# Altium project WR_NIC.PrjPcb (part 1 of 3)
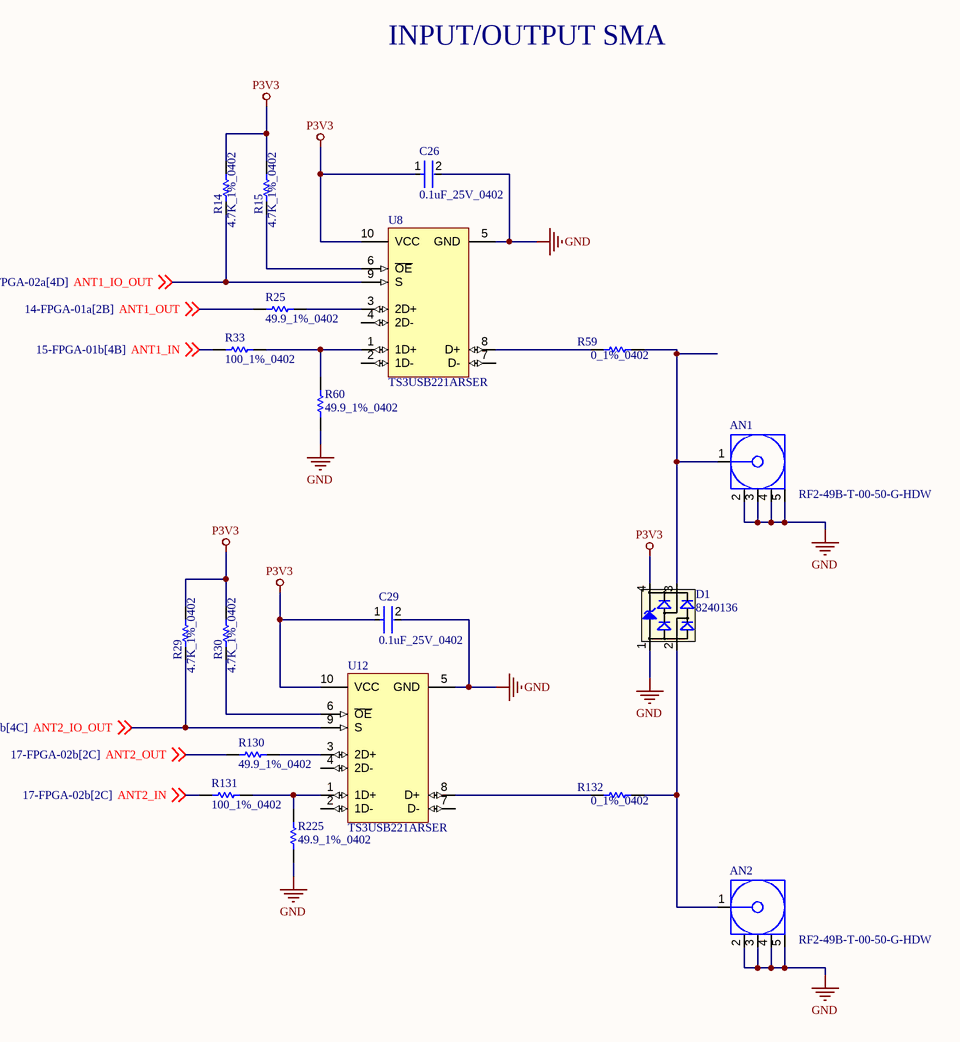
[diagram p0: 02-USER_IO.SchDoc]
ProjectDate: 09/14/21; ProjectRevision: P3
10 sheets, 312 parts. Net scope: global (net labels, ports and power ports of the same name join across sheets).
Board file: WR_NIC_V1.PcbDoc
Sheets:
  02-USER_IO.SchDoc
  03-USER_IO_STATUS.SchDoc
  07-DPLL-1.SchDoc
  10-JTAG.SchDoc
  11-DisplayPort.SchDoc
  12-USB Phy and Hub.SchDoc
  15-FPGA-01b.SchDoc
  17-FPGA-02b.SchDoc
  18-Power-P3V3.SchDoc
  19-Power-P5V.SchDoc

## Sheet 02-USER_IO.SchDoc
size Tabloid; DocumentNumber: 1; SheetNumber: 2; SheetTotal: 17

### Parts
AN1  RF2-49B-T-00-50-G-HDW  [AMPH-901-143-6RFX_V]
AN2  RF2-49B-T-00-50-G-HDW  [AMPH-901-143-6RFX_V]
C26  0.1uF_25V_0402  [FP-0402-L_1_0_1-W_0_5_0_1-IPC_C]
C29  0.1uF_25V_0402  [FP-0402-L_1_0_1-W_0_5_0_1-IPC_C]
D1  8240136  [SOT143-4L]
R14  4.7K_1%_0402  [RESC1005X40X25NL10T10]
R15  4.7K_1%_0402  [RESC1005X40X25NL10T10]
R25  49.9_1%_0402  [RESC1005X40X25NL10T10]
R29  4.7K_1%_0402  [RESC1005X40X25NL10T10]
R30  4.7K_1%_0402  [RESC1005X40X25NL10T10]
R33  100_1%_0402  [RESC1005X40X25NL05T10]
R59  0_1%_0402  [RESC1005X40X25LL05T05]
R60  49.9_1%_0402  [RESC1005X40X25NL10T10]
R130  49.9_1%_0402  [RESC1005X40X25NL10T10]
R131  100_1%_0402  [RESC1005X40X25NL05T10]
R132  0_1%_0402  [RESC1005X40X25LL05T05]
R225  49.9_1%_0402  [RESC1005X40X25NL10T10]
U8  TS3USB221ARSER  [RSE0010A_V]
U12  TS3USB221ARSER  [RSE0010A_V]

### Nets
GND: AN1.2 AN1.3 AN1.4 AN1.5 AN2.2 AN2.3 AN2.4 AN2.5 C26.2 C29.2 D1.1(GND) R60.1 R225.1 U8.5(GND) U12.5(GND)
P3V3: C26.1 C29.1 D1.4(VDD) R14.1 R15.1 R29.1 R30.1 U8.10(VCC) U12.10(VCC)
ANT1_IN: R33.1 ; off-sheet ANT1_IN
ANT1_IO_OUT: R14.2 U8.9(S) ; off-sheet ANT1_IO_OUT
ANT1_OUT: R25.1 ; off-sheet ANT1_OUT
ANT2_IN: R131.1 ; off-sheet ANT2_IN
ANT2_IO_OUT: R29.2 U12.9(S) ; off-sheet ANT2_IO_OUT
ANT2_OUT: R130.1 ; off-sheet ANT2_OUT
NetAN1_1: AN1.1 D1.3(I/O2) R59.2
NetAN2_1: AN2.1 D1.2(I/O1) R132.2
NetR15_2: R15.2 U8.6(~{OE})
NetR25_2: R25.2 U8.3(2D+)
NetR30_2: R30.2 U12.6(~{OE})
NetR33_2: R33.2 R60.2 U8.1(1D+)
NetR59_1: R59.1 U8.8(D+)
NetR130_2: R130.2 U12.3(2D+)
NetR131_2: R131.2 R225.2 U12.1(1D+)
NetR132_1: R132.1 U12.8(D+)

Not connected (* = marked no-connect by the designer): U8 2(1D-) 4(2D-) 7(D-); U12 2(1D-) 4(2D-) 7(D-)

### Notes on the sheet
- INPUT/OUTPUT SMA
- SHEET
- REV
- timingcard.com <http://timingcard.com>
- DATE
- OF

### Library data of the parts
AN1 AN2 = CMP-2000-05705-1: Coaxial connector, 50 Ohm, -65 to 165 degC, 5-Pin THD, RoHS, Bulk; Manufacturer: Amphenol; Catalog Drawings: 901-143-6RFXMountingHole; 3D Model: 901-143-6RFX.igs; Body Material: Brass; Connector Type: Jack,FemaleSocket; Shield Termination: Solder; Other Names: 901-143-6-RFX9011436RFXARFX1232; Online Catalog: SMA,RFX; Frequency - Max: 18GHz; Body Finish: Gold; Dielectric Material: Polytetrafluoroethylene(PTFE); Center Contact Material: BerylliumCopper; Impedance: 50Ohm; Connector Style: SMA; Mounting Technology: ThroughHole; Mounting Type: ThroughHole,RightAngle; Cable Group: -; Series: -; Package Description: 5-Pin Through Hole Device, Body 7 x 7 mm, Pitch 2.54 mm; Package Reference: 901-143-6RFX; Voltage Rating: -; Standard Package: 1; Fastening Type: Threaded; Housing Color: Gold; Datasheet URL: http://www.amphenolrf.com/downloads/dl/file/id/2712/product/3102/901_143_6rfx_customer_drawing.pdf; Family: CoaxialConnectors(RF); Contact Termination: Solder; Manufacturer URL: http://www.amphenol.com/; Operating Temperature: -65°C~165°C; Category: Connectors,Interconnects; Packaging: Bulk; Features: -; Center Contact Plating: Gold; Datasheet Version: Rev. C, 06/2010; Ingress Protection: -
C26 C29 = CMP-2008-02519-2: General Purpose Ceramic Capacitor, 0402, 100nF, 10%, X7R, 15%, 25V; Package Quantity: 1; Capacitance: 100nF; Min Operating Temperature: -55°C; Voltage: 25V; Voltage Rating: 25V; Construction: Flat; Max Operating Temperature: 125°C; Radiation Hardening: No; Depth: 0.5mm; Thickness: 0.022inch; Voltage Rating (DC): 25V; Number of Pins: 2; Lead Free: Lead Free; Series: -; REACH SVHC: No SVHC; Length: 1mm; Dielectric: X7R; RoHS Compliant: Yes; Mount: Surface Mount; Packaging: Tape and Reel; Case/Package: 0402; Case Code (Imperial): 0402; Termination: SMD/SMT; Width: 0.02inch; Case Code (Metric): 1005; Tolerance: 10%
D1 = CMP-1486-00002-1: TVS Diode WE-TVS-HS, VRWM=3.3V; Manufacturer: Wuerth Elektronik; Reverse Stand Off Voltage: 3.3V; PartNumber: 8240136; ComponentLink1Description: Manufacturer URL; PackageReference: SOT143-4L; ComponentLink1URL: http://www.we-online.com; ComponentLink2Description: Datasheet; ComponentLink2URL: http://katalog.we-online.de/kataloge/eisos/media/pdf/8240136.pdf
R14 R15 R29 R30 = CMP-2002-05217-1: Manufacturer: Bourns; Part Number: CR0402-FX-4701GLF
R25 R60 R130 R225 = CMP-2002-04448-1: Part Number: RK73H1ETTP49R9F; Manufacturer: KOA Speer
R33 R131 = CMP-2002-07853-1: Manufacturer: Yageo; Part Number: RC0402FR-13100RL
R59 R132 = CMP-2000-07451-1: Chip Resistor, 0 Ohm, 0.1 W, -55 to 155 degC, 0402 (1005 Metric), RoHS, Tape and Reel; Manufacturer: Panasonic; Voltage Rating (DC): 50V; Temperature Coefficient: 600ppm/��C; Max Power Dissipation: 100mW; Resistance: 0mOhm; Tolerance: 5%; Number of Terminations: 2; Mount: SurfaceMount; Height: 0.35mm; Packaging: TapeandReel; Contact Plating: Tin; Manufacturer URL: http://www.panasonic.com/; Composition: ThickFilm; Max Operating Temperature: 155degC; REACH SVHC: NoSVHC; Case/Package: 0402; Package Reference: 402; Depth: 0.5mm; Package Description: 2-Pin Surface Mount Device, Body 1 x 0.5 mm; Datasheet URL: https://industrial.panasonic.com/cdbs/www-data/pdf/RDA0000/AOA0000C301.pdf; RoHSCompliant: True; Case Code (Imperial): 0402; Military Standard: Not; Min Operating Temperature: -55degC; Power Rating: 100mW; Datasheet Version: 03/2015; Length: 1mm; Case Code (Metric): 1005; Termination: SMD/SMT; Mounting Technology: SurfaceMount; Voltage Rating: 50V; Width: 0.02inch; Package Quantity: 1; Lead Free: LeadFree; Radiation Hardening: No
U8 U12 = CMP-0309-00017-2: ESD Protected,High-Speed USB 2.0 (480-Mbps) 1:2 Multiplexer / Demultiplexer Switch, 1:2 Mux / Demux, 6 ohm RON, 2.5 to 3.3V, -40 to 85 degC, 10-Pin UQFN (RSE), Green (RoHS & no Sb/Br); Manufacturer: Texas Instruments; tpd max(ns): 0.25; RON Mis-match(Max)(Ohms): 0.2; OFF Time(Max)(ns): 12; Architecture: "1","2 mux/demux"; IL OFF(Max)(nA): 2; SubFamily: USB Switch; ESD HBM(kV): +/-7; ron(max)(ohms): 6; ON Time(Max)(ns): 30; Bandwidth(MHz): 900; RON Flatness(Max)(Ohms): 1; Vcc range(V): 2.3 to 3.6; Mounting Technology: Surface Mount; ComponentLink2URL: http://www.ti.com/lit/ml/mpqf186c/mpqf186c.pdf; PackageDescription: 10-Leads Plastic Quad Flatpack No-Lead, 2 x 1.5 x 0.55 mm Body, 0.5 mm Pitch; ComponentLink1URL: http://www.ti.com/general/docs/lit/getliterature.tsp?genericPartNumber=TS3USB221A&fileType=pdf; PackageReference: RSE0010A; ComponentLink2Description: Package Specification; PartNumber: TS3USB221ARSER; Code_JEDEC: MO-288-UEFD; DatasheetVersion: SCDS277; ComponentLink1Description: Datasheet; Eco-Plan: Green (RoHS & no Sb/Br); Number of Channels: 2; PackageVersion: revD, Jan-2011; ICC(uA): 30

## Sheet 03-USER_IO_STATUS.SchDoc: Time Card
size B; SheetNumber: 3; SheetTotal: 19; ENG_APP_DATE: --/--/--; DSN_APP_DATE: --/--/--; CHK_APP_DATE: --/--/--
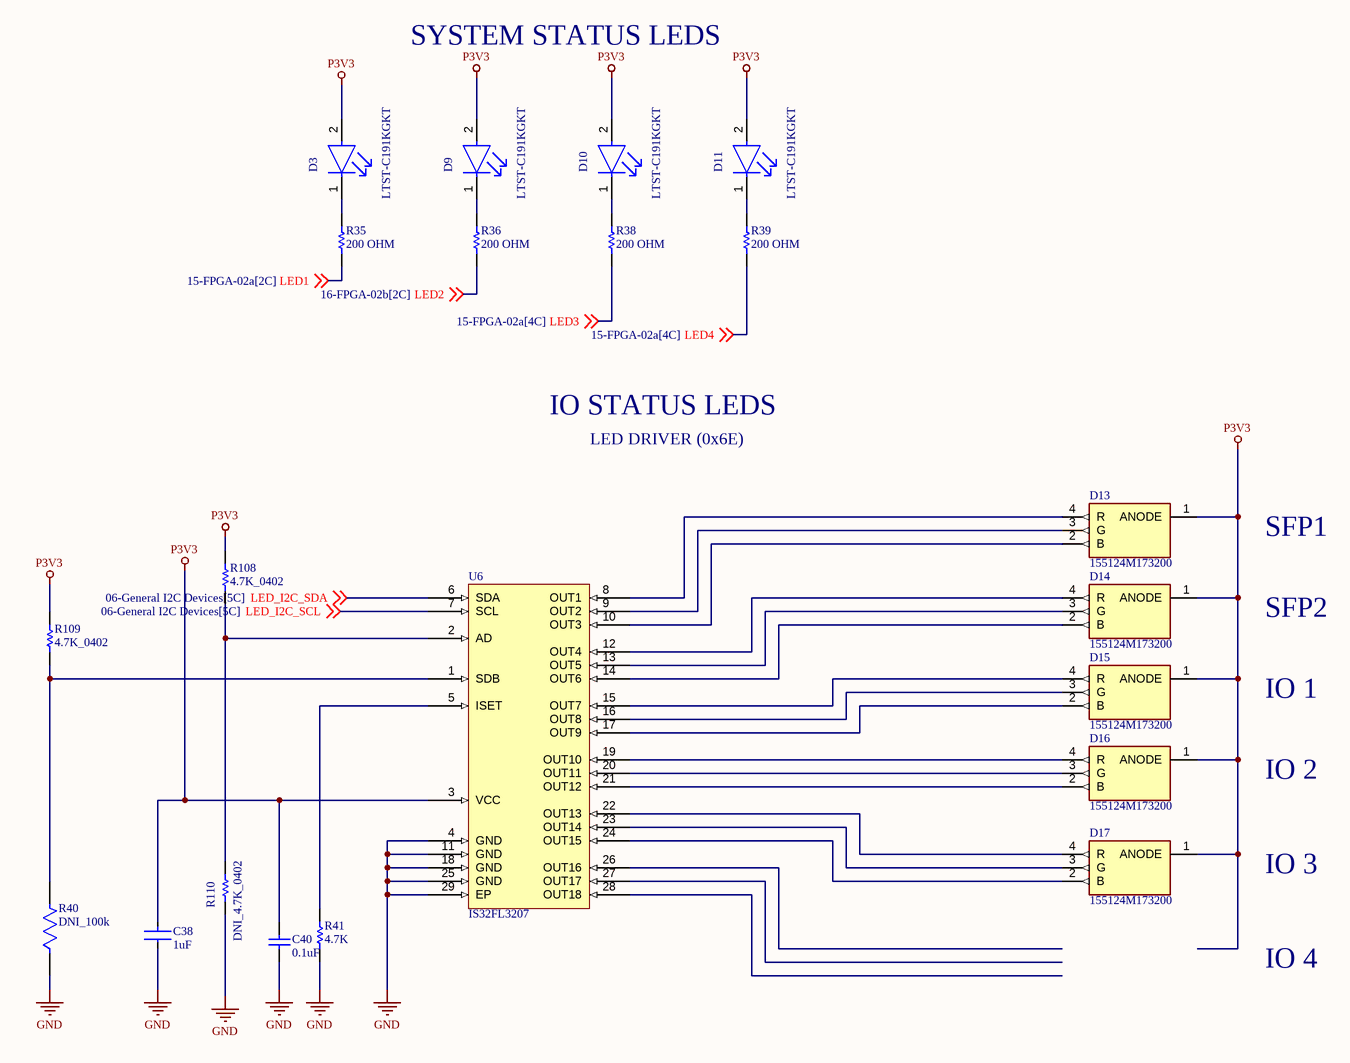
[diagram p1: 03-USER_IO_STATUS.SchDoc]

### Parts
C38  1uF  [FP-C0603C105K3PACTU-MFG]
C40  0.1uF  [CAPC1608X87X45ML20T05]
D3  LTST-C191KGKT  [FP-LTST-C191KGKT-MFG]
D9  LTST-C191KGKT  [FP-LTST-C191KGKT-MFG]
D10  LTST-C191KGKT  [FP-LTST-C191KGKT-MFG]
D11  LTST-C191KGKT  [FP-LTST-C191KGKT-MFG]
D13  155124M173200  [155124M173200]
D14  155124M173200  [155124M173200]
D15  155124M173200  [155124M173200]
D16  155124M173200  [155124M173200]
D17  155124M173200  [155124M173200]
R35  200 OHM  [RESC1608X55X30NL15T15]
R36  200 OHM  [RESC1608X55X30NL15T15]
R38  200 OHM  [RESC1608X55X30NL15T15]
R39  200 OHM  [RESC1608X55X30NL15T15]
R40  DNI_100k  [FP-RC0603-0_55-MFG]  (no BOM)
R41  4.7K  [RESC1608X55X30NL15T15]
R108  4.7K_0402  [RESC1005X40X25LL05T05]
R109  4.7K_0402  [RESC1005X40X25LL05T05]
R110  DNI_4.7K_0402  [RESC1005X40X25LL05T05]  (no BOM)
U6  IS32FL3207  [IS32FL3207]

### Nets
GND: C38.2 C40.1 R40.1 R41.1 R110.2 U6.4(GND) U6.11(GND) U6.18(GND) U6.25(GND) U6.29(EP)
P3V3: C38.1 C40.2 D3.2(A) D9.2(A) D10.2(A) D11.2(A) D13.1(ANODE) D14.1(ANODE) D15.1(ANODE) D16.1(ANODE) D17.1(ANODE) R108.1 R109.1 U6.3(VCC)
LED1: R35.1 ; off-sheet LED1
LED2: R36.1 ; off-sheet LED2
LED3: R38.1 ; off-sheet LED3
LED4: R39.1 ; off-sheet LED4
LED_I2C_SCL: U6.7(SCL) ; off-sheet LED_I2C_SCL
LED_I2C_SDA: U6.6(SDA) ; off-sheet LED_I2C_SDA
NetD3_1: D3.1(C) R35.2
NetD9_1: D9.1(C) R36.2
NetD10_1: D10.1(C) R38.2
NetD11_1: D11.1(C) R39.2
NetD13_2: D13.2(B) U6.10(OUT3)
NetD13_3: D13.3(G) U6.9(OUT2)
NetD13_4: D13.4(R) U6.8(OUT1)
NetD14_2: D14.2(B) U6.14(OUT6)
NetD14_3: D14.3(G) U6.13(OUT5)
NetD14_4: D14.4(R) U6.12(OUT4)
NetD15_2: D15.2(B) U6.17(OUT9)
NetD15_3: D15.3(G) U6.16(OUT8)
NetD15_4: D15.4(R) U6.15(OUT7)
NetD16_2: D16.2(B) U6.21(OUT12)
NetD16_3: D16.3(G) U6.20(OUT11)
NetD16_4: D16.4(R) U6.19(OUT10)
NetD17_2: D17.2(B) U6.24(OUT15)
NetD17_3: D17.3(G) U6.23(OUT14)
NetD17_4: D17.4(R) U6.22(OUT13)
NetR40_2: R40.2 R109.2 U6.1(SDB)
NetR41_2: R41.2 U6.5(ISET)
NetR108_2: R108.2 R110.1 U6.2(AD)

Not connected (* = marked no-connect by the designer): U6 26(OUT16) 27(OUT17) 28(OUT18)

### Notes on the sheet
- SYSTEM STATUS LEDS
- IO STATUS LEDS
- LED DRIVER (0x6E)
- SFP1
- SFP2
- IO 1
- IO 2
- IO 3
- IO 4
- DWG. NO.
- REV.
- SHT.
- THIS DOCUMENT AND THE DATA DISCLOSED HEREIN OR HEREWITH IS THE PROPERTY OF ALTIUM LIMITED AND MAY BE FREELY DISTRIBUTED IN WHOLE. NO RIGHTS ARE RESERVED OR EXPRESS OR IMPLIED WARANTEE GIVEN.
- REVISION
- DESCRIPTION
- DATE
- APPROVED
- ENG:
- APPROVALS
- PROJECT
- DSN:
- CHK:
- REFERENCE DOCUMENTS
- PROJECT REVISION:
- TITLE
- DOCUMENT REVISION:
- DESIGN ITEM:
- BOM:
- FAB DWG:
- PCB DWG:
- ASSY DWG:
- SCALE:
- SIZE
- B
- CAGE CODE
- FILE NAME
- DWG NO.
- SHEET
- OF
- REV

### Library data of the parts
C38 = CMP-2006-02216-3: CAP CER 1UF 25V X5R 0603; Dielectric Material: Ceramic; Tolerance: 10%; Contact Plating: Tin; Number of Pins: 2; Lead Free: Lead Free; Depth: 0.8mm; Length: 1.6mm; Mount: Surface Mount; Case Code (Metric): 1608; Max Operating Temperature: 85°C; Voltage: 25V; Voltage Rating (DC): 25V; REACH SVHC: No SVHC; Height: 0.8mm; Series: C0603C; Case/Package: 0603; Case Code (Imperial): 0603; Capacitance: 1uF; RoHS Compliant: Yes; Dielectric: X5R; Packaging: Tape and Reel; Construction: Flat; Thickness: 0.034inch; Voltage Rating: 25V; Radiation Hardening: No; Width: 0.031inch; Min Operating Temperature: -55°C; Termination: SMD/SMT; Package Quantity: 4000
C40 = CMP-2006-00003-1: C0603X104K5RACAUTO; Manufacturer: Kemet; Part Number: C0603X104K5RACAUTO
D3 D9-D11 = CMP-2000-05198-2: LED GREEN CLEAR SMD; Max Power Dissipation: 75mW; Forward Current: 30mA; Reverse Voltage: 5V; Lens Color: Colorless; Forward Voltage: 2V; Dominant Wavelength: 571nm; Number of LEDs: 1; Viewing Angle: 130°; Lens Style: Rectangular; Test Current: 20mA; Luminous Intensity: 35mcd; Wavelength: 574nm; Width: 0.8mm; Case Code (Imperial): 0603; Number of Pins: 2; Lead Free: Lead Free; Packaging: Tape and Reel; Package Quantity: 1; Min Operating Temperature: -55°C; Case/Package: 0603; Length: 1.6mm; Power Dissipation: 75mW; Depth: 0.8mm; Radiation Hardening: No; Mount: Surface Mount; Max Operating Temperature: 85°C; Color: Green; Power Rating: 75mW; Height: 0.55mm; Illumination Color: Green; Case Code (Metric): 1608; Lens Transparency: Clear; Number of Elements: 1
D13-D17 = 155124M173200: LED (Multiple); Manufacturer_Name: Wurth Elektronik; Datasheet Link: https://www.mouser.com/ds/2/445/155124M173200-1113601.pdf; Manufacturer_Part_Number: 155124M173200; Mouser Part Number: 710-155124M173200; Mouser Price/Stock: https://www.mouser.co.uk/ProductDetail/Wurth-Elektronik/155124M173200?qs=5aG0NVq1C4xPhoUU07x4gQ%3D%3D
R35 R36 R38 R39 = CMP-2000-00316-1: ERJ-3EKF2000V; Manufacturer: Panasonic; Part Number: ERJ-3EKF2000V
R40 = CMP-2100-03662-2: RES SMD 100K OHM 1% 1/10W 0603; Voltage Rating (DC): 50V; Resistance: 100kR; Max Power Dissipation: 100mW; Temperature Coefficient: 100ppm/°C; Working Voltage: 75V; Length: 1.6mm; Lead Free: Lead Free; Number of Terminations: 2; Packaging: Tape and Reel; Voltage Rating: 50V; Termination: SMD/SMT; Width: 0.8mm; Resistor Type: Thick Film; Resistance Tolerance: 1%; Features: Moisture Resistant; Height: 0.45mm; Construction: Rectangular; Case/Package: 0603; Military Standard: Not; Case Code (Imperial): 0603; Series: RC; Technology: THICK FILM; Depth: 0.8mm; RoHS Compliant: Yes; REACH SVHC: No SVHC; Min Operating Temperature: -55°C; Case Code (Metric): 1608; Max Operating Temperature: 155°C; Power Rating: 100mW; Number of Pins: 2; Tolerance: 1%
R41 = CMP-1012-00586-3: Precision Thick Film Chip Resistor, 4.7 KOhm, +/- 1%, -55 to 155 degC, 0603 (1608 Metric), RoHS, Tape and Reel ERJ-3EKF4701V; Resistance: 220 Ohm; Voltage Rating: 50 V; Elements: 4; Case\Package: 1205; Tolerance: 5%; Power Rating: 250 mW; PackageReference: 0603; Max Operating Temperature: 125 degC; REACH SVHC: No SVHC; Width: 0.063 inch; Length: 0.126 inch; Height: 0.024 inch; Mount: Surface Mount; Package Quantity: 1; DatasheetVersion: Apr-15; ComponentLink1Description: Manufacturer URL; Min Operating Temperature: -55 degC; Packaging: Tape and Reel; Radiation Hardening: No; ComponentLink2URL: http://industrial.panasonic.com/cdbs/www-data/pdf/RDA0000/AOA0000C86.pdf; Case Code (Metric): 3216; Pins: 8; Case Code (Imperial): 1206; Type (Resistor): Thick Film; RoHSCompliant: true; ComponentLink2Description: Datasheet; PackageDescription: 2-Pin Surface Mount Device, Body 1.6 x 0.85 mm; ComponentLink1URL: http://www.panasonic.com/
R108-R110 = CMP-2002-01154-4: Chip Resistor, 4.7 KOhm, +/- 1%, 0.1 W, -55 to 155 degC, 0402 (1005 Metric), RoHS, Tape and Reel; PartNumber: ERJ-2RKF4701X; Voltage Rating: 50 V; Case\/Package: 0402; Power Rating: 100 mW; Height: 0.35 mm; Mounting Technology: Surface Mount; REACH SVHC: Yes; Resistance: 4.7 KOhm; Max Operating Temperature: 155 degC; ComponentLink1Description: Manufacturer URL; ComponentLink2Description: Datasheet; Pins: 2; PackageReference: 0402; Tolerance: 1%; Case Code (Imperial): 0402; Length: 1 mm; PackageDescription: 2-Pin Surface Mount Device, Body 1 x 0.5 mm; RoHSCompliant: true; Package Quantity: 1; Radiation Hardening: No; DatasheetVersion: 04/2015; Width: 0.5 mm; Case Code (Metric): 1005; Mount: Surface Mount; ComponentLink1URL: http://www.panasonic.com/; Min Operating Temperature: -55 degC; Packaging: Cut Tape; ComponentLink2URL: http://industrial.panasonic.com/cdbs/www-data/pdf/RDA0000/AOA0000C86.pdf

## Sheet 07-DPLL-1.SchDoc
size B; SheetNumber: 7; SheetTotal: 20
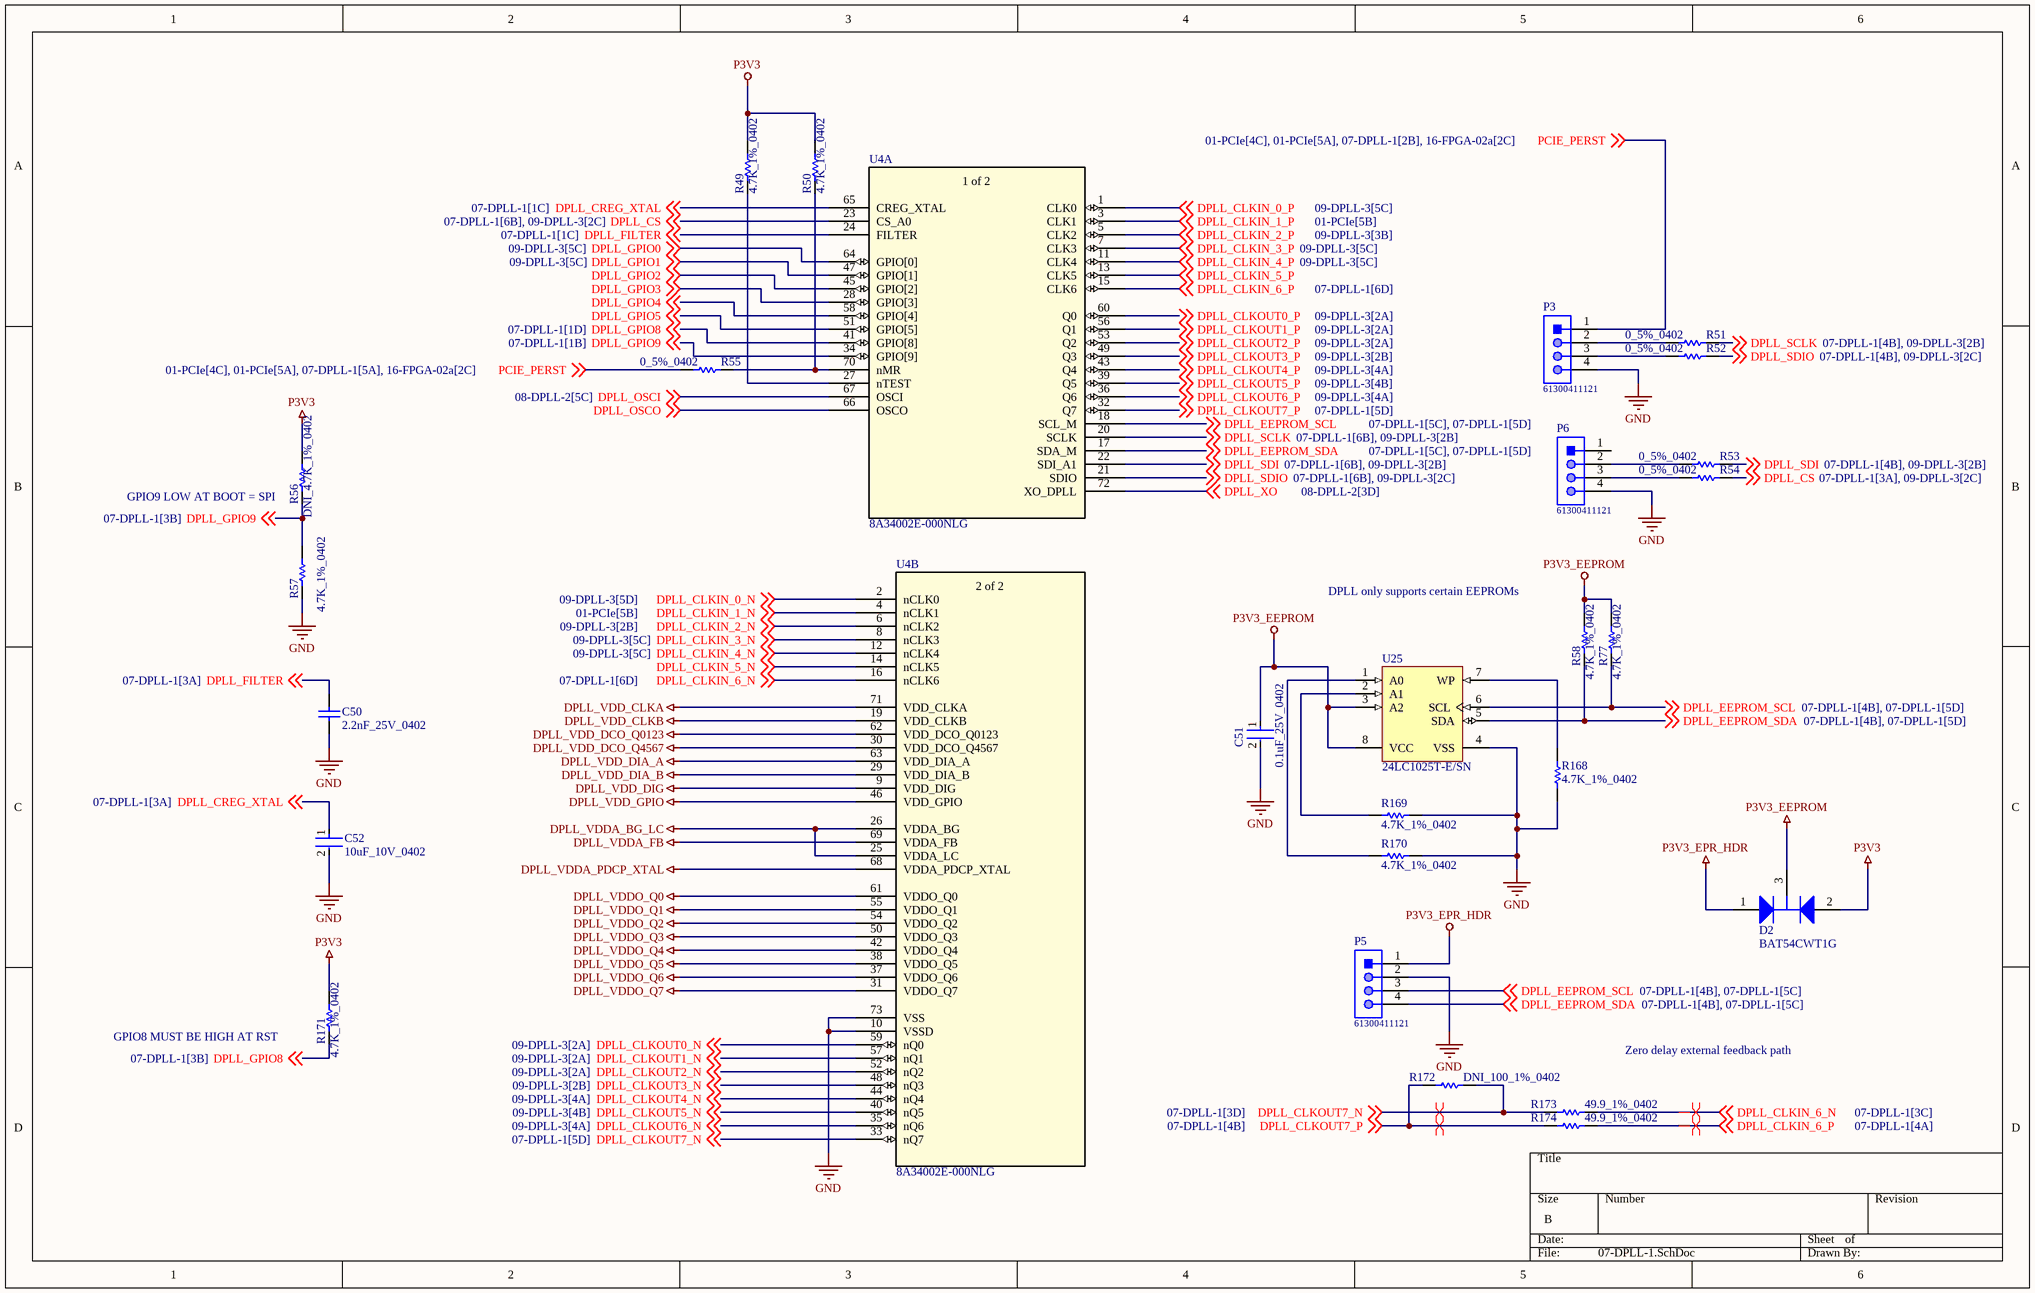
[diagram p2: 07-DPLL-1.SchDoc]

### Parts
C50  2.2nF_25V_0402  [CAPC1005X56X25LL10T15]
C51  0.1uF_25V_0402  [FP-0402-L_1_0_1-W_0_5_0_1-IPC_C]
C52  10uF_10V_0402  [FP-CL05A106MP5NUNC-MFG]
D2  BAT54CWT1G  [ONSC-SOT-323-3-419-04_V]
P3  61300411121  [61300411121]
P5  61300411121  [61300411121]
P6  61300411121  [61300411121]
R49  4.7K_1%_0402  [RESC1005X40X25NL10T10]
R50  4.7K_1%_0402  [RESC1005X40X25NL10T10]
R51  0_5%_0402  [RESC1005X40X25LL10T10]
R52  0_5%_0402  [RESC1005X40X25LL10T10]
R53  0_5%_0402  [RESC1005X40X25LL10T10]
R54  0_5%_0402  [RESC1005X40X25LL10T10]
R55  0_5%_0402  [RESC1005X40X25LL10T10]
R56  DNI_4.7K_1%_0402  [RESC1005X40X25NL10T10]  (no BOM)
R57  4.7K_1%_0402  [RESC1005X40X25NL10T10]
R58  4.7K_1%_0402  [RESC1005X40X25NL10T10]
R77  4.7K_1%_0402  [RESC1005X40X25NL10T10]
R168  4.7K_1%_0402  [RESC1005X40X25NL10T10]
R169  4.7K_1%_0402  [RESC1005X40X25NL10T10]
R170  4.7K_1%_0402  [RESC1005X40X25NL10T10]
R171  4.7K_1%_0402  [RESC1005X40X25NL10T10]
R172  DNI_100_1%_0402  [RESC1005X40X25LL05T05]  (no BOM)
R173  49.9_1%_0402  [RESC1005X40X25NL10T10]
R174  49.9_1%_0402  [RESC1005X40X25NL10T10]
U4  8A34002E-000NLG  [QFN_2E-000NLG_REN]  (parts A,B of 2)
U25  24LC1025T-E/SN  [SOIC-SN8_M]

### Nets
DPLL_VDD_CLKA: U4.71(VDD_CLKA)
DPLL_VDD_CLKB: U4.19(VDD_CLKB)
DPLL_VDD_DCO_Q0123: U4.62(VDD_DCO_Q0123)
DPLL_VDD_DCO_Q4567: U4.30(VDD_DCO_Q4567)
DPLL_VDD_DIA_A: U4.63(VDD_DIA_A)
DPLL_VDD_DIA_B: U4.29(VDD_DIA_B)
DPLL_VDD_DIG: U4.9(VDD_DIG)
DPLL_VDD_GPIO: U4.46(VDD_GPIO)
DPLL_VDDA_BG_LC: U4.25(VDDA_LC) U4.26(VDDA_BG)
DPLL_VDDA_FB: U4.69(VDDA_FB)
DPLL_VDDA_PDCP_XTAL: U4.68(VDDA_PDCP_XTAL)
DPLL_VDDO_Q0: U4.61(VDDO_Q0)
DPLL_VDDO_Q1: U4.55(VDDO_Q1)
DPLL_VDDO_Q2: U4.54(VDDO_Q2)
DPLL_VDDO_Q3: U4.50(VDDO_Q3)
DPLL_VDDO_Q4: U4.42(VDDO_Q4)
DPLL_VDDO_Q5: U4.38(VDDO_Q5)
DPLL_VDDO_Q6: U4.37(VDDO_Q6)
DPLL_VDDO_Q7: U4.31(VDDO_Q7)
GND: C50.1 C51.2 C52.2 P3.4 P5.2 P6.4 R57.1 R168.2 R169.1 R170.2 U4.10(VSSD) U4.73(VSS) U25.4(VSS)
P3V3: D2.2(A2) R49.2 R50.2 R56.1 R171.1
P3V3_EEPROM: C51.1 D2.3(K) R58.1 R77.1 U25.3(A2) U25.8(VCC)
P3V3_EPR_HDR: D2.1(A1) P5.1
DPLL_CLKIN_0_N: U4.2(nCLK0) ; off-sheet DPLL_CLKIN_0_N
DPLL_CLKIN_0_P: U4.1(CLK0) ; off-sheet DPLL_CLKIN_0_P
DPLL_CLKIN_1_N: U4.4(nCLK1) ; off-sheet DPLL_CLKIN_1_N
DPLL_CLKIN_1_P: U4.3(CLK1) ; off-sheet DPLL_CLKIN_1_P
DPLL_CLKIN_2_N: U4.6(nCLK2) ; off-sheet DPLL_CLKIN_2_N
DPLL_CLKIN_2_P: U4.5(CLK2) ; off-sheet DPLL_CLKIN_2_P
DPLL_CLKIN_3_N: U4.8(nCLK3) ; off-sheet DPLL_CLKIN_3_N
DPLL_CLKIN_3_P: U4.7(CLK3) ; off-sheet DPLL_CLKIN_3_P
DPLL_CLKIN_4_N: U4.12(nCLK4) ; off-sheet DPLL_CLKIN_4_N
DPLL_CLKIN_4_P: U4.11(CLK4) ; off-sheet DPLL_CLKIN_4_P
DPLL_CLKIN_5_N: U4.14(nCLK5) ; off-sheet DPLL_CLKIN_5_N
DPLL_CLKIN_5_P: U4.13(CLK5) ; off-sheet DPLL_CLKIN_5_P
DPLL_CLKIN_6_N: R173.2 U4.16(nCLK6) ; off-sheet DPLL_CLKIN_6_N
DPLL_CLKIN_6_P: R174.2 U4.15(CLK6) ; off-sheet DPLL_CLKIN_6_P
DPLL_CLKOUT0_N: U4.59(nQ0) ; off-sheet DPLL_CLKOUT0_N
DPLL_CLKOUT0_P: U4.60(Q0) ; off-sheet DPLL_CLKOUT0_P
DPLL_CLKOUT1_N: U4.57(nQ1) ; off-sheet DPLL_CLKOUT1_N
DPLL_CLKOUT1_P: U4.56(Q1) ; off-sheet DPLL_CLKOUT1_P
DPLL_CLKOUT2_N: U4.52(nQ2) ; off-sheet DPLL_CLKOUT2_N
DPLL_CLKOUT2_P: U4.53(Q2) ; off-sheet DPLL_CLKOUT2_P
DPLL_CLKOUT3_N: U4.48(nQ3) ; off-sheet DPLL_CLKOUT3_N
DPLL_CLKOUT3_P: U4.49(Q3) ; off-sheet DPLL_CLKOUT3_P
DPLL_CLKOUT4_N: U4.44(nQ4) ; off-sheet DPLL_CLKOUT4_N
DPLL_CLKOUT4_P: U4.43(Q4) ; off-sheet DPLL_CLKOUT4_P
DPLL_CLKOUT5_N: U4.40(nQ5) ; off-sheet DPLL_CLKOUT5_N
DPLL_CLKOUT5_P: U4.39(Q5) ; off-sheet DPLL_CLKOUT5_P
DPLL_CLKOUT6_N: U4.35(nQ6) ; off-sheet DPLL_CLKOUT6_N
DPLL_CLKOUT6_P: U4.36(Q6) ; off-sheet DPLL_CLKOUT6_P
DPLL_CLKOUT7_N: R172.2 R173.1 U4.33(nQ7) ; off-sheet DPLL_CLKOUT7_N
DPLL_CLKOUT7_P: R172.1 R174.1 U4.32(Q7) ; off-sheet DPLL_CLKOUT7_P
DPLL_CREG_XTAL: C52.1 U4.65(CREG_XTAL) ; off-sheet DPLL_CREG_XTAL
DPLL_CS: R54.2 U4.23(CS_A0) ; off-sheet DPLL_CS
DPLL_EEPROM_SCL: P5.3 R77.2 U4.18(SCL_M) U25.6(SCL) ; off-sheet DPLL_EEPROM_SCL
DPLL_EEPROM_SDA: P5.4 R58.2 U4.17(SDA_M) U25.5(SDA) ; off-sheet DPLL_EEPROM_SDA
DPLL_FILTER: C50.2 U4.24(FILTER) ; off-sheet DPLL_FILTER
DPLL_GPIO0: U4.64(GPIO[0]) ; off-sheet DPLL_GPIO0
DPLL_GPIO1: U4.47(GPIO[1]) ; off-sheet DPLL_GPIO1
DPLL_GPIO2: U4.45(GPIO[2]) ; off-sheet DPLL_GPIO2
DPLL_GPIO3: U4.28(GPIO[3]) ; off-sheet DPLL_GPIO3
DPLL_GPIO4: U4.58(GPIO[4]) ; off-sheet DPLL_GPIO4
DPLL_GPIO5: U4.51(GPIO[5]) ; off-sheet DPLL_GPIO5
DPLL_GPIO8: R171.2 U4.41(GPIO[8]) ; off-sheet DPLL_GPIO8
DPLL_GPIO9: R56.2 R57.2 U4.34(GPIO[9]) ; off-sheet DPLL_GPIO9
DPLL_OSCI: U4.67(OSCI) ; off-sheet DPLL_OSCI
DPLL_OSCO: U4.66(OSCO) ; off-sheet DPLL_OSCO
DPLL_SCLK: R51.2 U4.20(SCLK) ; off-sheet DPLL_SCLK
DPLL_SDI: R53.2 U4.22(SDI_A1) ; off-sheet DPLL_SDI
DPLL_SDIO: R52.2 U4.21(SDIO) ; off-sheet DPLL_SDIO
DPLL_XO: U4.72(XO_DPLL) ; off-sheet DPLL_XO
PCIE_PERST: P3.1 R55.1 ; off-sheet PCIE_PERST
NetP3_2: P3.2 R51.1
NetP3_3: P3.3 R52.1
NetP6_2: P6.2 R53.1
NetP6_3: P6.3 R54.1
NetR49_1: R49.1 U4.27(nTEST)
NetR50_1: R50.1 R55.2 U4.70(nMR)
NetR168_1: R168.1 U25.7(WP)
NetR169_2: R169.2 U25.2(A1)
NetR170_1: R170.1 U25.1(A0)

Not connected (* = marked no-connect by the designer): P6 1

### Layout directives
differential pair: DPLL_CLKIN_6_N, DPLL_CLKIN_6_P, DPLL_CLKOUT7_N, DPLL_CLKOUT7_P

### Notes on the sheet
- (near R56) GPIO9 LOW AT BOOT = SPI
- DPLL only supports certain EEPROMs
- GPIO8 MUST BE HIGH AT RST
- Zero delay external feedback path
- (in symbol 8A34002E-000NLG, part A) 1 of 2
- (in symbol 8A34002E-000NLG, part B) 2 of 2

### Library data of the parts
C50 = CMP-2008-02907-1: Manufacturer: AVX Interconnect / Elco; Part Number: 04025C222JAT2A
C51 = CMP-2008-02519-2: as C26 on sheet 02-USER_IO; Package Quantity: 1; Capacitance: 100nF; Min Operating Temperature: -55°C; Voltage: 25V; Voltage Rating: 25V; Construction: Flat; Max Operating Temperature: 125°C; Radiation Hardening: No; Depth: 0.5mm; Thickness: 0.022inch; Voltage Rating (DC): 25V; Number of Pins: 2; Lead Free: Lead Free; Series: -; REACH SVHC: No SVHC; Length: 1mm; Dielectric: X7R; RoHS Compliant: Yes; Mount: Surface Mount; Packaging: Tape and Reel; Case/Package: 0402; Case Code (Imperial): 0402; Termination: SMD/SMT; Width: 0.02inch; Case Code (Metric): 1005; Tolerance: 10%
C52 = CMP-13271-000002-1: CAP CER 10UF 10V X5R 0402; Manufacturer Part Number: CL05A106MP5NUNC; Manufacturer: Samsung; Temperature Coefficient: 15%; Tolerance: 20%; Material: Ceramic; Octopart: https://octopart.com/cl05a106mp5nunc-samsung-22457395; Voltage Rating: 10V; RoHS: TRUE; Value: 10uF; Height: 0.7mm; Digikey Description: CAP CER 10UF 10V X5R 0402; Automotive: No; Package: CL05A106MP5NUNC; Device Class L1: Passive Components; Capacitance: 10uF; Temperature Range High: +85°C; ComponentLink2Description: Datasheet; Device Class L2: Capacitors; Temperature Characteristic: X5R; Temperature: -55°C to +85°C; ComponentLink2URL: http://www.samsungsem.com/kr/support/product-search/mlcc/__icsFiles/afieldfile/2019/05/10/19-CL05A106MP5NUNC.pdf; Device Class L3: Ceramic Capacitors; Category: Cap; Temperature Range Low: -55°C; Ipc Land Pattern Name: CAPC10050X50; Lead Free: Yes
D2 = CMP-1055-00557-1: Dual Series Cathode Schottky Barrier Diodes, 3-Pin SOT-323, Pb-Free, Tape and Reel; Manufacturer: On Semiconductor; Configuration: Common Cathode; IFSM Max (A): 0.6; trr Max (ns): 5; ComponentLink2Description: Datasheet; Packing: Tape and Reel; ComponentLink3Description: Package Specification; Mounting Technology: Surface Mount; PartNumber: BAT54CWT1G; PackageVersion: Rev. N, 11/2008; RoHS: TRUE; ComponentLink3URL: http://www.onsemi.com/pub_link/Collateral/419-04.PDF; ComponentLink2URL: http://www.onsemi.cn/pub_link/Collateral/BAT54CWT1-D.PDF; PackageReference: SOT-323-3-419-04; ComponentLink1URL: http://www.onsemi.com/; ComponentLink1Description: Manufacturer URL; DatasheetVersion: Rev. 7; PackageDescription: 3-Pin Small Outline Transistor, Body 2 x 1.25 mm, Pitch 0.65 mm
P3 P5 P6 = CMP-1502-01064-1: THT Vertical Pin Header WR-PHD, Pitch 2.54 mm, Single Row, 4 pins; Manufacturer: Wurth Elektronik; Withstanding Voltage: 500VAC; Rated Current: 3A; Working Voltage: 250VAC; Pin Number: 4; Gender: Male; Contact Resistance: 20mOhm; Pitch: 2.54mm; Manufacturer URL: http://www.we-online.de; Operating Temperature: -40to105degC; Packaging: Bag; Mounting Technology: THT; Package Reference: 61300411121; Datasheet URL: https://katalog.we-online.de/em/datasheet/6130xx11121.pdf; Publisher: WurthElektronik; Part Number: 61300411121; Row Number: Single; Orientation: Vertical
R49 R50 R56-R58 R77 R168-R171 = CMP-2002-05217-1: as R14 on sheet 02-USER_IO
R51-R55 = CMP-2002-04569-1: Manufacturer: KOA Speer; Part Number: RK73Z1ETTP
R172 = CMP-2002-00605-3: Chip Resistor, 100 Ohm, +/- 1%, 100 mW, -55 to 155 degC, 0402 (1005 Metric), RoHS, Tape and Reel; Manufacturer: Basic Passives; PartNumber: ERJ-2RKF1000X; Power Rating: 100 mW; Resistance: 100 Ohm; Voltage Rating: 50 V; Case\/Package: 0402; Width: 0.5 mm; Pins: 2; ComponentLink2Description: Datasheet; PackageReference: 0402; Height: 0.35 mm; Tolerance: 1%; DatasheetVersion: 04/2015; Case Code (Imperial): 0402; Min Operating Temperature: -55 degC; Radiation Hardening: No; Length: 1 mm; Package Quantity: 10000; PackageDescription: 2-Pin Surface Mount Device, Body 1 x 0.5 mm; Mounting Technology: Surface Mount; Case Code (Metric): 1005; Packaging: Tape and Reel; ComponentLink1URL: http://www.panasonic.com/; RoHSCompliant: true; Max Operating Temperature: 155 degC; REACH SVHC: Yes; ComponentLink1Description: Manufacturer URL; ComponentLink2URL: http://industrial.panasonic.com/cdbs/www-data/pdf/RDA0000/AOA0000C86.pdf; Mount: Surface Mount
R173 R174 = CMP-2002-04448-1: as R25 on sheet 02-USER_IO
U4 = 8A34002E-000NLG: No Description Available; Mfr_Name: Renesas Electronics; RefDes: RefDes; Type: Type
U25 = CMP-0159-00340-1: 1 Mbit, 400kHz, 2.5V, 8-Pin SOIC 150mil, Extended Temperature, Tape and Reel; Code_JEDEC: MS-012; PackageVersion: revBB, Aug-2009; PackageDescription: 8-Lead Plastic Small Outline (SN) - Narrow, 3.90mm Body [SOIC]; DatasheetVersion: revF, Oct-2008; PackageReference: SOIC-SN8; Code_IPC: SOIC127P600-8

## Sheet 10-JTAG.SchDoc
size C; SheetNumber: 10; SheetTotal: 20
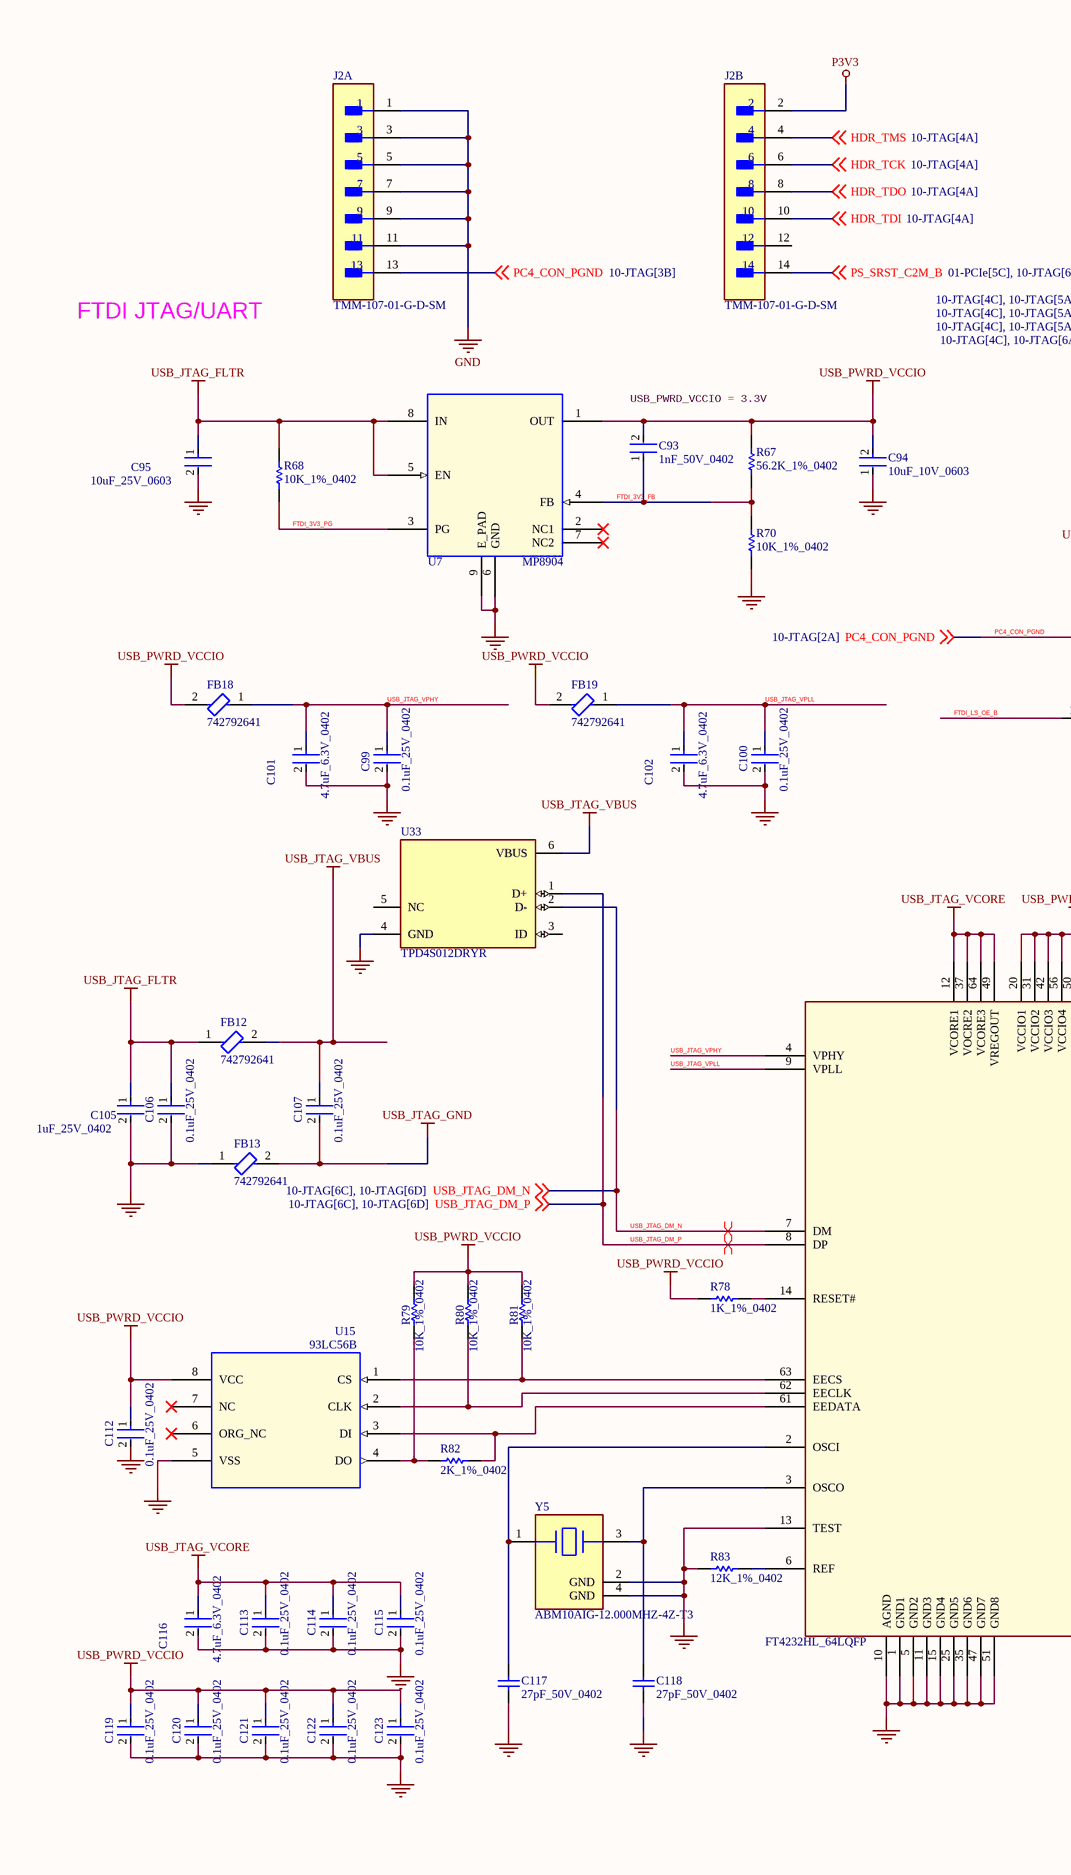
[diagram p3: 10-JTAG.SchDoc, left]
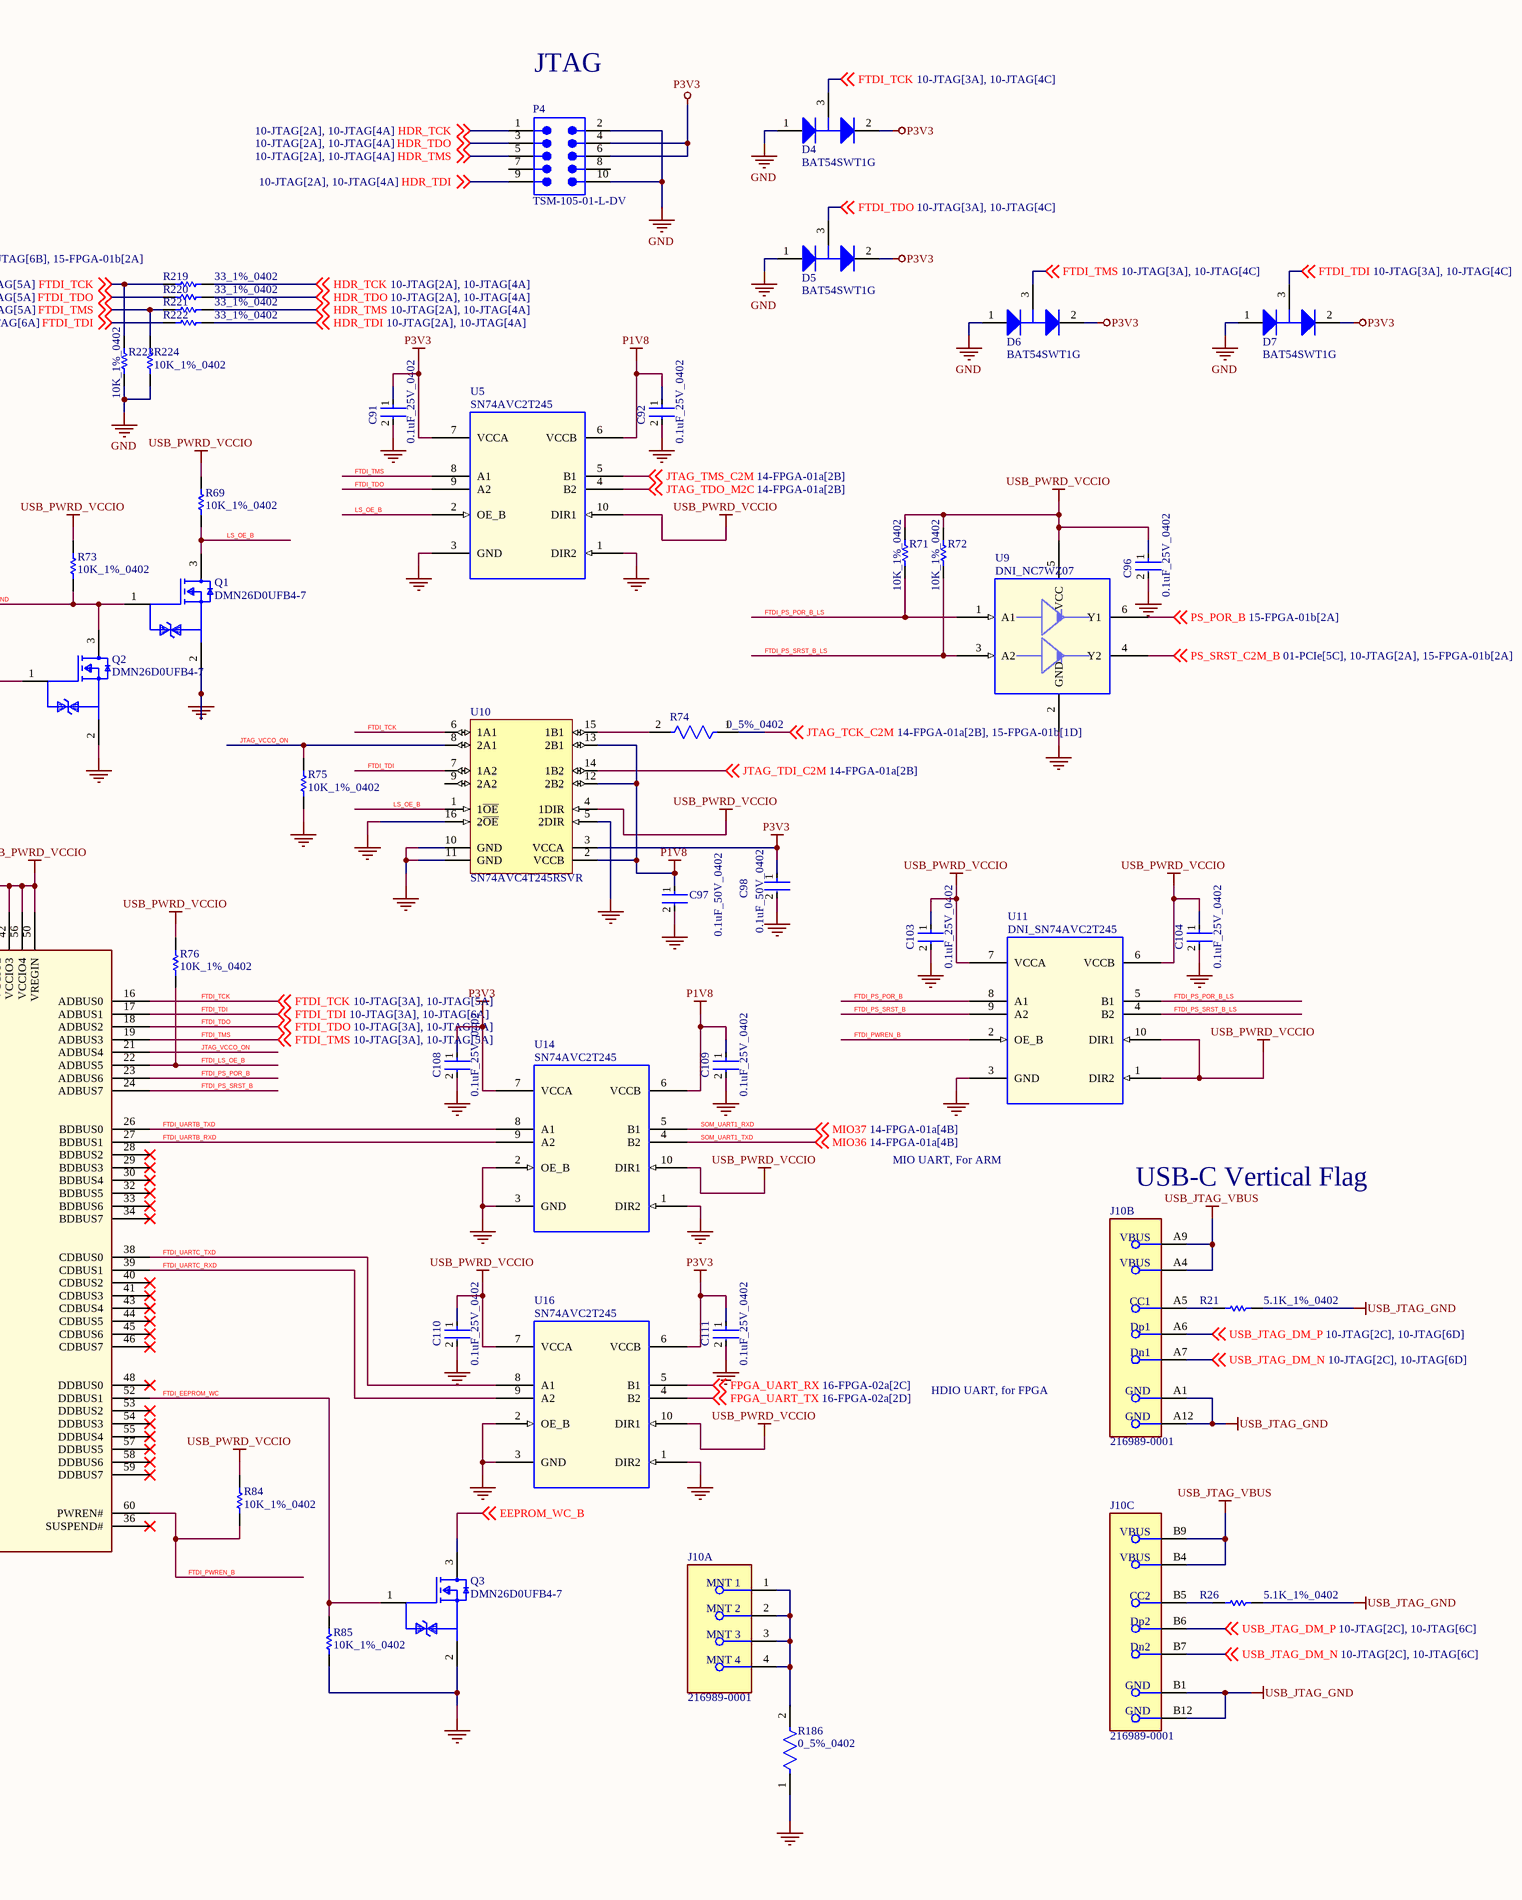
[diagram p4: 10-JTAG.SchDoc, right]

### Parts
C91  0.1uF_25V_0402  [FP-0402-L_1_0_1-W_0_5_0_1-IPC_C]
C92  0.1uF_25V_0402  [FP-0402-L_1_0_1-W_0_5_0_1-IPC_C]
C93  1nF_50V_0402  [FP-CGA2B-MFG]
C94  10uF_10V_0603  [FP-C1608-080-0_1-MFG]
C95  10uF_25V_0603  [FP-CL10-IPC_C]
C96  0.1uF_25V_0402  [FP-0402-L_1_0_1-W_0_5_0_1-IPC_C]
C97  0.1uF_50V_0402  [FP-C1005-050-0_05-IPC_C]
C98  0.1uF_50V_0402  [FP-C1005-050-0_05-IPC_C]
C99  0.1uF_25V_0402  [FP-0402-L_1_0_1-W_0_5_0_1-IPC_C]
C100  0.1uF_25V_0402  [FP-0402-L_1_0_1-W_0_5_0_1-IPC_C]
C101  4.7uF_6.3V_0402  [FP-C1005-050-0_15-IPC_C]
C102  4.7uF_6.3V_0402  [FP-C1005-050-0_15-IPC_C]
C103  0.1uF_25V_0402  [FP-0402-L_1_0_1-W_0_5_0_1-IPC_C]
C104  0.1uF_25V_0402  [FP-0402-L_1_0_1-W_0_5_0_1-IPC_C]
C105  1uF_25V_0402  [FP-CL542-IPC_C]
C106  0.1uF_25V_0402  [FP-0402-L_1_0_1-W_0_5_0_1-IPC_C]
C107  0.1uF_25V_0402  [FP-0402-L_1_0_1-W_0_5_0_1-IPC_C]
C108  0.1uF_25V_0402  [FP-0402-L_1_0_1-W_0_5_0_1-IPC_C]
C109  0.1uF_25V_0402  [FP-0402-L_1_0_1-W_0_5_0_1-IPC_C]
C110  0.1uF_25V_0402  [FP-0402-L_1_0_1-W_0_5_0_1-IPC_C]
C111  0.1uF_25V_0402  [FP-0402-L_1_0_1-W_0_5_0_1-IPC_C]
C112  0.1uF_25V_0402  [FP-0402-L_1_0_1-W_0_5_0_1-IPC_C]
C113  0.1uF_25V_0402  [FP-0402-L_1_0_1-W_0_5_0_1-IPC_C]
C114  0.1uF_25V_0402  [FP-0402-L_1_0_1-W_0_5_0_1-IPC_C]
C115  0.1uF_25V_0402  [FP-0402-L_1_0_1-W_0_5_0_1-IPC_C]
C116  4.7uF_6.3V_0402  [FP-C1005-050-0_15-IPC_C]
C117  27pF_50V_0402  [CAPC1005X55X25LL05T10]
C118  27pF_50V_0402  [CAPC1005X55X25LL05T10]
C119  0.1uF_25V_0402  [FP-0402-L_1_0_1-W_0_5_0_1-IPC_C]
C120  0.1uF_25V_0402  [FP-0402-L_1_0_1-W_0_5_0_1-IPC_C]
C121  0.1uF_25V_0402  [FP-0402-L_1_0_1-W_0_5_0_1-IPC_C]
C122  0.1uF_25V_0402  [FP-0402-L_1_0_1-W_0_5_0_1-IPC_C]
C123  0.1uF_25V_0402  [FP-0402-L_1_0_1-W_0_5_0_1-IPC_C]
D4  BAT54SWT1G  [ONSC-SOT-323-3-419-04_V]
D5  BAT54SWT1G  [ONSC-SOT-323-3-419-04_V]
D6  BAT54SWT1G  [ONSC-SOT-323-3-419-04_V]
D7  BAT54SWT1G  [ONSC-SOT-323-3-419-04_V]
FB12  742792641  [FP-742792641-MFG]
FB13  742792641  [FP-742792641-MFG]
FB18  742792641  [FP-742792641-MFG]
FB19  742792641  [FP-742792641-MFG]
J2  TMM-107-01-G-D-SM  [FP-TMM-107-01-G-D-SM-MFG]  (parts A,B of 2)
J10  216989-0001  [FP-216989-0001-MFG]  (parts A,B,C of 3)
P4  TSM-105-01-L-DV  [SMTC-TSM-105-01-X-DV]
Q1  DMN26D0UFB4-7  [FP-X2-DFN1006-3-MFG]
Q2  DMN26D0UFB4-7  [FP-X2-DFN1006-3-MFG]
Q3  DMN26D0UFB4-7  [FP-X2-DFN1006-3-MFG]
R21  5.1K_1%_0402  [RESC1005X40X25ML10T10]
R26  5.1K_1%_0402  [RESC1005X40X25ML10T10]
R67  56.2K_1%_0402  [RESC1005X40X25LL05T05]
R68  10K_1%_0402  [RESC1005X40X25ML05T05]
R69  10K_1%_0402  [RESC1005X40X25ML05T05]
R70  10K_1%_0402  [RESC1005X40X25ML05T05]
R71  10K_1%_0402  [RESC1005X40X25ML05T05]
R72  10K_1%_0402  [RESC1005X40X25ML05T05]
R73  10K_1%_0402  [RESC1005X40X25ML05T05]
R74  0_5%_0402  [FP-AC0402-0_37-IPC_B]
R75  10K_1%_0402  [RESC1005X40X25ML05T05]
R76  10K_1%_0402  [RESC1005X40X25ML05T05]
R78  1K_1%_0402  [RESC1005X40X25NL05T05]
R79  10K_1%_0402  [RESC1005X40X25ML05T05]
R80  10K_1%_0402  [RESC1005X40X25ML05T05]
R81  10K_1%_0402  [RESC1005X40X25ML05T05]
R82  2K_1%_0402  [RESC1005X40X25LL10T10]
R83  12K_1%_0402  [RESC1005X40X25ML10T10]
R84  10K_1%_0402  [RESC1005X40X25ML05T05]
R85  10K_1%_0402  [RESC1005X40X25ML05T05]
R186  0_5%_0402  [FP-AC0402-0_37-IPC_B]
R219  33_1%_0402  [RESC1005X40X25NL05T10]
R220  33_1%_0402  [RESC1005X40X25NL05T10]
R221  33_1%_0402  [RESC1005X40X25NL05T10]
R222  33_1%_0402  [RESC1005X40X25NL05T10]
R223  10K_1%_0402  [RESC1005X40X25ML05T05]
R224  10K_1%_0402  [RESC1005X40X25ML05T05]
U5  SN74AVC2T245  [QFN40P140X180X55-10]
U7  MP8904  [QFN_MP8904DD_8]
U9  DNI_NC7WZ07  [SC70_6]
U10  SN74AVC4T245RSVR  [RSV0016A_V]
U11  DNI_SN74AVC2T245  [QFN40P140X180X55-10]  (no BOM)
U13  FT4232HL_64LQFP  [LQFP_64]
U14  SN74AVC2T245  [QFN40P140X180X55-10]
U15  93LC56B  [SOIC8P127W390]
U16  SN74AVC2T245  [QFN40P140X180X55-10]
U33  TPD4S012DRYR  [FP-DRY0006A-MFG]
Y5  ABM10AIG-12.000MHZ-4Z-T3  [FP-ABM10AIG-MFG]

### Nets
GND: C91.2 C92.2 C94.1 C95.2 C96.2 C97.2 C98.2 C99.2 C100.2 C101.2 C102.2 C103.2 C104.2 C105.2 C106.2 C108.2 C109.2 C110.2 C111.2 C112.2 C113.2 C114.2 C115.2 C116.2 C117.1 C118.1 C119.2 C120.2 C121.2 C122.2 C123.2 D4.1(A) D5.1(A) D6.1(A) D7.1(A) FB13.1 J2.1 J2.3 J2.5 J2.7 J2.9 J2.11 P4.2 P4.10 Q1.2(S) Q2.2(S) Q3.2(S) R70.1 R75.1 R83.1 R85.1 R186.1 R223.1 R224.1 U5.1(DIR2) U5.3(GND) U7.6(GND) U7.9(E_PAD) U9.2(GND) U10.5(2DIR) U10.10(GND) U10.11(GND) U10.16(2~{OE}) U11.3(GND) U13.1(GND1) U13.5(GND2) U13.10(AGND) U13.11(GND3) U13.13(TEST) U13.15(GND4) U13.25(GND5) U13.35(GND6) U13.47(GND7) U13.51(GND8) U14.1(DIR2) U14.2(OE_B) U14.3(GND) U15.5(VSS) U16.1(DIR2) U16.2(OE_B) U16.3(GND) U33.4(GND) Y5.2(GND) Y5.4(GND)
P1V8: C92.1 C97.1 C109.1 U5.6(VCCB) U10.2(VCCB) U10.12(2B2) U10.13(2B1) U14.6(VCCB)
P3V3: C91.1 C98.1 C108.1 C111.1 D4.2(K) D5.2(K) D6.2(K) D7.2(K) J2.2 P4.4 P4.6 U5.7(VCCA) U10.3(VCCA) U14.7(VCCA) U16.6(VCCB)
USB_JTAG_FLTR: C95.1 C105.1 C106.1 FB12.1 R68.2 U7.5(EN) U7.8(IN)
USB_JTAG_GND: C107.2 FB13.2 J10.A1(GND) J10.A12(GND) J10.B1(GND) J10.B12(GND) R21.2 R26.2
USB_JTAG_VBUS: C107.1 FB12.2 J10.A4(VBUS) J10.A9(VBUS) J10.B4(VBUS) J10.B9(VBUS) U33.6(VBUS)
USB_JTAG_VCORE: C113.1 C114.1 C115.1 C116.1 U13.12(VCORE1) U13.37(VOCRE2) U13.49(VREGOUT) U13.64(VCORE3)
USB_PWRD_VCCIO: C93.2 C94.2 C96.1 C103.1 C104.1 C110.1 C112.1 C119.1 C120.1 C121.1 C122.1 C123.1 FB18.2 FB19.2 R67.2 R69.2 R71.2 R72.2 R73.2 R76.2 R78.1 R79.2 R80.2 R81.2 R84.2 U5.10(DIR1) U7.1(OUT) U9.5(VCC) U10.4(1DIR) U11.1(DIR2) U11.6(VCCB) U11.7(VCCA) U11.10(DIR1) U13.20(VCCIO1) U13.31(VCCIO2) U13.42(VCCIO3) U13.50(VREGIN) U13.56(VCCIO4) U14.10(DIR1) U15.8(VCC) U16.7(VCCA) U16.10(DIR1)
EEPROM_WC_B: Q3.3(D) ; off-sheet EEPROM_WC_B
FPGA_UART_RX: U16.5(B1) ; off-sheet FPGA_UART_RX
FPGA_UART_TX: U16.4(B2) ; off-sheet FPGA_UART_TX
FTDI_3V3_FB: C93.1 R67.1 R70.2 U7.4(FB)
FTDI_3V3_PG: R68.1 U7.3(PG)
FTDI_EEPROM_WC: Q3.1(G) R85.2 U13.52(DDBUS1)
FTDI_LS_OE_B: Q2.1(G) R76.1 U13.22(ADBUS5)
FTDI_PS_POR_B: U11.8(A1) U13.23(ADBUS6)
FTDI_PS_POR_B_LS: R71.1 U9.1(A1) U11.5(B1)
FTDI_PS_SRST_B: U11.9(A2) U13.24(ADBUS7)
FTDI_PS_SRST_B_LS: R72.1 U9.3(A2) U11.4(B2)
FTDI_PWREN_B: R84.1 U11.2(OE_B) U13.60(PWREN#)
FTDI_TCK: D4.3(K/A) R219.1 R223.2 U10.6(1A1) U13.16(ADBUS0) ; off-sheet FTDI_TCK
FTDI_TDI: D7.3(K/A) R222.1 U10.7(1A2) U13.17(ADBUS1) ; off-sheet FTDI_TDI
FTDI_TDO: D5.3(K/A) R220.1 U5.9(A2) U13.18(ADBUS2) ; off-sheet FTDI_TDO
FTDI_TMS: D6.3(K/A) R221.1 R224.2 U5.8(A1) U13.19(ADBUS3) ; off-sheet FTDI_TMS
FTDI_UARTB_RXD: U13.27(BDBUS1) U14.9(A2)
FTDI_UARTB_TXD: U13.26(BDBUS0) U14.8(A1)
FTDI_UARTC_RXD: U13.39(CDBUS1) U16.9(A2)
FTDI_UARTC_TXD: U13.38(CDBUS0) U16.8(A1)
HDR_TCK: J2.6 P4.1 R219.2 ; off-sheet HDR_TCK
HDR_TDI: J2.10 P4.9 R222.2 ; off-sheet HDR_TDI
HDR_TDO: J2.8 P4.3 R220.2 ; off-sheet HDR_TDO
HDR_TMS: J2.4 P4.5 R221.2 ; off-sheet HDR_TMS
JTAG_TCK_C2M: R74.1 ; off-sheet JTAG_TCK_C2M
JTAG_TDI_C2M: U10.14(1B2) ; off-sheet JTAG_TDI_C2M
JTAG_TDO_M2C: U5.4(B2) ; off-sheet JTAG_TDO_M2C
JTAG_TMS_C2M: U5.5(B1) ; off-sheet JTAG_TMS_C2M
JTAG_VCCO_ON: R75.2 U10.8(2A1) U13.21(ADBUS4)
LS_OE_B: Q1.3(D) R69.1 U5.2(OE_B) U10.1(1~{OE})
PC4_CON_PGND: J2.13 Q1.1(G) Q2.3(D) R73.1 ; off-sheet PC4_CON_PGND
PS_POR_B: U9.6(Y1) ; off-sheet PS_POR_B
PS_SRST_C2M_B: J2.14 U9.4(Y2) ; off-sheet PS_SRST_C2M_B
SOM_UART1_RXD: U14.5(B1) ; off-sheet MIO37  [also labelled MIO37]
SOM_UART1_TXD: U14.4(B2) ; off-sheet MIO36  [also labelled MIO36]
USB_JTAG_DM_N: J10.A7(Dn1) J10.B7(Dn2) U13.7(DM) U33.2(D-) ; off-sheet USB_JTAG_DM_N
USB_JTAG_DM_P: J10.A6(Dp1) J10.B6(Dp2) U13.8(DP) U33.1(D+) ; off-sheet USB_JTAG_DM_P
USB_JTAG_VPHY: C99.1 C101.1 FB18.1 U13.4(VPHY)
USB_JTAG_VPLL: C100.1 C102.1 FB19.1 U13.9(VPLL)
NetC117_2: C117.2 U13.2(OSCI) Y5.1(1_Crystal)
NetC118_2: C118.2 U13.3(OSCO) Y5.3(2_Crystal)
NetJ10_1: J10.1(MNT_1) J10.2(MNT_2) J10.3(MNT_3) J10.4(MNT_4) R186.2
NetJ10_A5: J10.A5(CC1) R21.1
NetJ10_B5: J10.B5(CC2) R26.1
NetR74_2: R74.2 U10.15(1B1)
NetR78_2: R78.2 U13.14(RESET#)
NetR79_1: R79.1 R82.1 U15.4(DO)
NetR80_1: R80.1 U13.62(EECLK) U15.2(CLK)
NetR81_1: R81.1 U13.63(EECS) U15.1(CS)
NetR82_2: R82.2 U13.61(EEDATA) U15.3(DI)
NetR83_2: R83.2 U13.6(REF)

Not connected (* = marked no-connect by the designer): J2 12; P4 7 8; U7 2(NC1)* 7(NC2)*; U10 9(2A2); U13 28(BDBUS2)* 29(BDBUS3)* 30(BDBUS4)* 32(BDBUS5)* 33(BDBUS6)* 34(BDBUS7)* 36(SUSPEND#)* 40(CDBUS2)* 41(CDBUS3)* 43(CDBUS4)* 44(CDBUS5)* 45(CDBUS6)* 46(CDBUS7)* 48(DDBUS0)* 53(DDBUS2)* 54(DDBUS3)* 55(DDBUS4)* 57(DDBUS5)* 58(DDBUS6)* 59(DDBUS7)*; U15 6(ORG_NC)* 7(NC)*; U33 3(ID) 5(NC)

### Layout directives
differential pair: USB_JTAG_DM_N, USB_JTAG_DM_P

### Notes on the sheet
- JTAG
- FTDI JTAG/UART
- USB_PWRD_VCCIO = 3.3V
- MIO UART, For ARM
- USB-C Vertical Flag
- HDIO UART, for FPGA

### Library data of the parts
C91 C92 C96 C99 C100 C103 C104 C106-C115 C119-C123 = CMP-2008-02519-2: as C26 on sheet 02-USER_IO; Package Quantity: 1; Capacitance: 100nF; Min Operating Temperature: -55°C; Voltage: 25V; Voltage Rating: 25V; Construction: Flat; Max Operating Temperature: 125°C; Radiation Hardening: No; Depth: 0.5mm; Thickness: 0.022inch; Voltage Rating (DC): 25V; Number of Pins: 2; Lead Free: Lead Free; Series: -; REACH SVHC: No SVHC; Length: 1mm; Dielectric: X7R; RoHS Compliant: Yes; Mount: Surface Mount; Packaging: Tape and Reel; Case/Package: 0402; Case Code (Imperial): 0402; Termination: SMD/SMT; Width: 0.02inch; Case Code (Metric): 1005; Tolerance: 10%
C93 = CMP-08246-002303-1: Cap Ceramic 1nF 50V X7R 10% Pad SMD 0402 +125°C Automotive T/R; Width: 0.02inch; Thickness: 0.022inch; Min Operating Temperature: -55°C; Mount: Surface Mount; Voltage Rating (DC): 50V; Voltage Rating: 50V; Termination: SMD/SMT; Capacitance: 1nF; Case/Package: 0402; Depth: 0.5mm; Length: 1mm; Ratings: AEC-Q200; Height: 0.5mm; Dielectric: X7R; Radiation Hardening: No; Lead Free: Lead Free; Composition: Ceramic; Max Operating Temperature: 125°C; Case Code (Imperial): 0402; Tolerance: 10%; Case Code (Metric): 1005; REACH SVHC: No SVHC; Package Quantity: 1; Packaging: Tape and Reel; Weight: 2.3E-05oz
C94 = CMP-2000-04979-3: Multilayer Ceramic Capacitors 10μF ±10% 10V X5R SMD 0603; Capacitance: 10uF; Dielectric Material: Ceramic; Construction: Flat; Height: 0.8mm; Thickness: 0.035inch; Case Code (Metric): 1608; Radiation Hardening: No; Number of Pins: 2; Voltage Rating (DC): 10V; Depth: 0.8mm; Voltage: 10V; RoHS Compliant: Yes; Voltage Rating: 10V; Package Quantity: 1; Resistor Type: Ceramic; Termination: SMD/SMT; Lead Free: Lead Free; REACH SVHC: No SVHC; Tolerance: 10%; Mount: Surface Mount; Series: C; Packaging: Tape and Reel; Width: 0.8mm; Dielectric: X5R; Weight: 7.1E-05oz; Length: 1.6mm; Max Operating Temperature: 85°C; Case Code (Imperial): 0603; Case/Package: 0603; Min Operating Temperature: -55°C
C95 = CMP-13271-004224-1: Cap Ceramic 10uF 25V X5R ±20% Pad SMD 0603 +85°C T/R; Width: 0.031inch; Voltage Rating: 25V; Length: 0.063inch; Case Code (Metric): 1608; Dielectric: X5R; Termination: Wraparound; Capacitance: 10uF; Lead Free: Lead Free; Mount: Surface Mount; Package Quantity: 1; Case Code (Imperial): 0603; Thickness: 0.035inch; Packaging: Tape and Reel; Contact Plating: Tin; Min Operating Temperature: -55°C; Tolerance: 20%; Max Operating Temperature: 85°C; Case/Package: 0603
C97 C98 = CMP-2000-05393-2: Multilayer Ceramic Capacitors 100nF ±10% 50V X7R SMD 0402; Voltage: 50V; Dielectric Material: Ceramic; Min Operating Temperature: -55°C; Depth: 0.5mm; Radiation Hardening: No; RoHS Compliant: Yes; Voltage Rating (DC): 50V; Lead Free: Lead Free; Resistor Type: Ceramic; Height: 0.5mm; Dielectric: X7R; Thickness: 0.022inch; Case/Package: 0402; Case Code (Metric): 1005; Termination: SMD/SMT; Capacitance: 100nF; Packaging: Tape and Reel; Max Operating Temperature: 125°C; Mount: Surface Mount; Package Quantity: 1; Width: 0.02inch; Weight: 2.3E-05oz; Voltage Rating: 50V; Tolerance: 10%; Construction: Flat; Case Code (Imperial): 0402; Length: 1mm; REACH SVHC: No SVHC; Series: C
C101 C102 C116 = CMP-08246-005457-1: CAP CER 4.7UF 6.3V X5R 0402; Dissipation Factor: 10%; Tolerance: 20%; Dielectric Material: Ceramic; Min Operating Temperature: -55°C; Construction: Flat; Voltage Rating (DC): 6.3V; Case Code (Metric): 1005; Voltage: 6.3V; Thickness: 0.026inch; Lead Free: Lead Free; Weight: 2.3E-05oz; Height: 0.5mm; Series: C; Case/Package: 0402; Capacitance: 4.7uF; Dielectric: X5R; Case Code (Imperial): 0402; Width: 0.02inch; Radiation Hardening: No; Packaging: Tape and Reel; Resistor Type: Ceramic; Termination: SMD/SMT; Max Operating Temperature: 85°C; REACH SVHC: No SVHC; Mount: Surface Mount; Package Quantity: 1; Length: 1mm; Voltage Rating: 6.3V; Depth: 0.5mm
C105 = CMP-13271-001051-1: Cap Ceramic 1uF 25V X5R ±10% SMD 0402 +85°C Paper T/R; Radiation Hardening: No; Lead Free: Lead Free; Capacitance: 1uF; Package Quantity: 10000; Max Operating Temperature: 85°C; Voltage Rating: 25V; Case/Package: 0402; Min Operating Temperature: -55°C; Packaging: Tape and Reel; Tolerance: 10%; Height: 0.5mm; Thickness: 0.022inch; Case Code (Metric): 1005; Width: 0.02inch; Case Code (Imperial): 0402; Dielectric: X5R; Length: 1mm; Mount: Surface Mount; Material: Ceramic; Depth: 0.5mm
C117 C118 = CMP-2008-03917-1: Part Number: GRM1555C1H270JA01D; Manufacturer: Murata
D4-D7 = CMP-1055-00559-1: Dual Series Schottky Barrier Diodes, 3-Pin SOT-323, Pb-Free, Tape and Reel; Manufacturer: On Semiconductor; trr Max (ns): 5; IFSM Max (A): 0.6; ComponentLink1URL: http://www.onsemi.com/; Mounting Technology: Surface Mount; ComponentLink1Description: Manufacturer URL; ComponentLink3URL: http://www.onsemi.com/pub_link/Collateral/419-04.PDF; RoHS: TRUE; PackageVersion: Rev. N, 11/2008; Packing: Tape and Reel; PackageReference: SOT-323-3-419-04; ComponentLink2URL: http://www.onsemi.cn/pub_link/Collateral/BAT54SWT1-D.PDF; ComponentLink3Description: Package Specification; PackageDescription: 3-Pin Small Outline Transistor, Body 2 x 1.25 mm, Pitch 0.65 mm; ComponentLink2Description: Datasheet; PartNumber: BAT54SWT1G; DatasheetVersion: Rev. 10; Configuration: Dual
FB12 FB13 FB18 FB19 = CMP-0220-00171-2: FERRITE BEAD 300 OHM 0603 1LN; Inductance: 18nH; Max DC Current: 2A; Number of Lines: 1; Test Frequency: 100MHz; Impedance: 300R; DC Resistance (DCR): 150mR; Tolerance: 25%; Case Code (Metric): 1608; Core Material: Ferrite; Length: 1.6mm; Lead Free: Lead Free; Series: WE-CBF; Min Operating Temperature: -55°C; RoHS Compliant: Yes; Case/Package: SMD/SMT; Material: Ferrite; Max Operating Temperature: 125°C; Termination: SMD/SMT; Packaging: Tape and Reel; Weight: 0.000141oz; Case Code (Imperial): 0603; Width: 0.8mm; Mount: Surface Mount; Max Current Rating: 2A; Package Quantity: 1; Depth: 0.8mm; Current Rating: 2A; Height: 0.8mm
J2 = CMP-02766-001657-1: CONN HEADER SMD 14POS 2MM; Number of Positions: 14; Max Current Rating: 3.9A; Connector Type: Male Pin; Max Voltage Rating (AC): 500V; Gender: Male; Row Spacing: 0.079inch; Max Operating Temperature: 125°C; Contact Type: Male Pin; Contact Plating: Gold; Length: 14mm; Color: Black; Contact Mating Length: 0.126inch; Radiation Hardening: No; Lead Pitch: 2mm; Series: TMM; Housing Color: Black; Depth: 3.94mm; Package Quantity: 41; REACH SVHC: No SVHC; Number of Contacts: 14; Lead Free: Lead Free; Number of Rows: 2; Contact Material: Bronze; Pitch: 2mm; Mount: Surface Mount; Min Operating Temperature: -55°C; Orientation: Straight; Current Rating: 3.9A; Packaging: Bulk; Termination: Solder; Housing Material: Polymer; Voltage Rating: 500V
J10 = CMP-04767-000020-1: CONN RCPT USB2.0 TYPE C 24POS RA
P4 = CMP-1024-00233-1: 0.025" SQ Post Header, Surface Mount, Vertical, -55 to 125 degC, 2.54 mm Pitch, 10-Pin, Male, RoHS; Manufacturer: Samtec; Pitch: 2.54 mm; ComponentLink1URL: http://www.samtec.com; DatasheetVersion: F-214; ComponentLink3URL: http://www.samtec.com/documents/webfiles/cpdf/TSM-1XX-XX-XXX-XX-X-XXX-X-MKT.pdf; Temperature Range: -55 to 125 degC; PackageDescription: Double Row Gullwing ASM; PartNumber: TSM-105-01-L-DV; ComponentLink2URL: http://www.samtec.com/documents/webfiles/pdf/TSM.PDF; ComponentLink2Description: Datasheet; Mounting Technology: Surface Mount; PackageVersion: DJ, 4/1991; RoHS: True; ComponentLink3Description: Package Specification; PackageReference: TSM-105-01-X-DV; Orientation: Vertical; ComponentLink1Description: Manufacturer URL
Q1-Q3 = CMP-12801-000049-1: MOSFET N-CH 20V 230MA DFN; Manufacturer: Diodes Inc.; Threshold Vgs Max: 0.9V; Input Capacitace At Vds: 14.1pF @ 15V; Depletion Mode: False; Pulse Drain Current: 805mA; Threshold Vgs Min: 0.6V; Gate To Source Voltage: 10V; Max Junction Temp: +150°C; Turn On Delay Time: 3.8ns; Automotive Grade: Grade 0; Turn Off Delay Time: 13.4ns; Power Dissipation: 350mW; Standoff Height: 0mm; Transconductance: 0.242S; Number Of N Channels: 1; Drain To Source Resistance: 1.8Ω; Continuous Drain Current: 240mA; Max Forward Diode Voltage: 1.4V; Rthja Max: 357°C/W; Device Class L3: MOSFETs; Temperature: -55°C to +150°C; Footprint Url: https://www.diodes.com/assets/Package-Files/X2-DFN1006-3.pdf; Mouser Description: MOSFET ENHANCE MODE MOSFET 20V N-Chan; Device Class L1: Discrete Semiconductors; Height: 0.4mm; RoHS: TRUE; Digikey Description: MOSFET N-CH 20V 230MA DFN; Temperature Range Low: -55°C; Category: Trans; Temperature Range High: +150°C; Automotive: Yes; Drain To Source Voltage: 20V; ComponentLink2URL: https://www.diodes.com/assets/Datasheets/ds31775.pdf; Drain To Source Breakdown Voltage: 20V; ComponentLink2Description: Datasheet; Device Class L2: Transistors; Octopart: https://octopart.com/dmn26d0ufb4-7-diodes+inc.-17947794; Package: X2-DFN1006-3; Lead Free: Yes; Manufacturer Part Number: DMN26D0UFB4-7; Number Of Channels: 1
R21 R26 = CMP-2002-04046-1: Manufacturer: KOA Speer; Part Number: RK73H1ETTP5101F
R67 = CMP-2002-00996-1: Part Number: ERJ-2RKF5622X; Manufacturer: Panasonic
R68-R73 R75 R76 R79-R81 R84 R85 R223 R224 = CMP-2002-00433-1: Part Number: ERJ-2GEJ103X; Manufacturer: Panasonic
R74 R186 = CMP-2002-01772-2: RESISTOR 0402 JUMPER ZERO OHM; Voltage Rating: 50V; Temperature Coefficient: 200ppm/°C; Tolerance: 1%; Power Rating: 62.5mW; Resistance: 0R; Min Operating Temperature: -55°C; Termination: SMD/SMT; Case/Package: 0402; Case Code (Imperial): 0402; Packaging: Tape and Reel; Case Code (Metric): 1005; Max Operating Temperature: 155°C; Series: AC
R78 = CMP-2002-08277-1: Manufacturer: Vishay Dale; Part Number: CRCW04021K00FKTD
R82 = CMP-2002-06093-1: Manufacturer: Multicomp; Part Number: MC00625W040212K
R83 = CMP-2002-03841-1: Manufacturer: KOA Speer; Part Number: RK73H1ETTP1202F
R219-R222 = CMP-2002-07881-1: Part Number: RC0402FR-1333RL; Manufacturer: Yageo
U5 U11 U14 U16 = SN74AVC2T245: IC Lvl Trans 2-Bit Bidir 500Mbps 1.2-3.6V 50mA UQFN-10; Manufacturer PN: SN74AVC2T245RSWR; Manufacturer: TEXAS INSTRUMENTS; Agile Part Number: ICS-00048-01; EDMVersionID: 493023062; Barcode: 500012; PCB Footprint: QFN40P140X180X55-10; CIP Link: http://xsjbrdwin1/CIP-E/Component/Index/All?pn=500012; Part Type: BUS TRANSCEIVER
U7 = MP8904: IC LDO 6.5V 500mA Adj QFN-8; Manufacturer PN: MP8904DD-LF-Z; Manufacturer: Monolithic Power Systems Inc.; Agile Part Number: ICS-00581-01; EDMVersionID: 491667633; Barcode: 96000022; Datasheet: https://www.monolithicpower.com/pub/media/document/MP8904_r1.02.pdf; PCB Footprint: QFN_MP8904DD_8; Part Type: LDO; CIP Link: http://xsjbrdwin1/CIP-E/Component/Index/All?pn=96000022
U9 = NC7WZ07: IC Buffer Dual 5V 50mA 3.9nSec SC70-6 Open Drain; Manufacturer PN: NC7WZ07P6X; Manufacturer: ON Semiconductor; Agile Part Number: ICS-00102-01; Barcode: 500086; CIP Link: http://xsjbrdwin1/CIP-E/Component/Index/All?pn=500086; Part Type: CMOS LOGIC; ROHS: Yes; Family: CMOS LOGIC; PCB Footprint: SC70_6
U10 = CMP-2000-07132-1: Dual-Bit Bus Transceiver with Configurable Voltage Translation and 3-State Output, 1.2 to 3.6 V, -40 to 85 degC, 16-Pin UQFN (RSV), Green (RoHS & no Sb/Br), Tape and Reel; Manufacturer: Texas Instruments; Propagation Delay Time: 10.3ns; Polarity: Non-Inverting; Low Level Output Current: 12mA; High Level Output Current: -12mA; Quiescent Current: 80uA; Logic Family: AVC; Input Logic Level: CMOS; Number of  Elements: 2; Number of Channels: 4; Operating Supply Voltage (Typ): 1.8/2.5/3.3V; Operating Supply Voltage (Min): 1.2V; Operating Supply Voltage (Max): 3.6V; Technology: CMOS; Package Type: uQFN; Manufacturer URL: http://www.ti.com/; Packaging: TapeandReel; Package URL: http://www.ti.com/lit/ml/mpqf205c/mpqf205c.pdf; Pin Count: 16; Operating Temperature (Max): 85C; Mounting: SurfaceMount; Operating Temperature (Min): -40C; Operating Temperature Classification: Industrial; Package Reference: RSV0016A; Mounting Technology: SurfaceMount; Datasheet Version: Rev. G, 11/2014; Operating Temp Range: -40Cto85C; Rad Hardened: No; Datasheet URL: http://www.ti.com/lit/ds/symlink/sn74avc4t245.pdf; Output Logic Level: CMOS; Output Type: 3-State; Package Description: 16-Pin Quad Flat No-lead Package, Body 1.8 x 2.6 mm, Pitch 0.4 mm
U13 = FT4232HL
U15 = 93LC56B: IC EEPROM 2Kb 128x16-Bit Serial 2MHz 2.5V SOIC-8; Manufacturer PN: 93LC56B-I/SN; Manufacturer: MICROCHIP; Agile Part Number: ICS-00335-01; Barcode: 500495; ROHS: YES; Family: MEMORY; Part Type: MEMORY; CIP Link: http://xsjbrdwin1/CIP-E/Component/Index/All?pn=500495; PCB Footprint: SOIC8P127W390
U33 = CMP-0326-00038-4: TVS DIODE 5.5V 6SON; Breakdown Voltage: 24V; Interface: USB; ESD Protection: Yes; Peak Pulse Power: 60W; Number of Circuits: 4; Polarity: Unidirectional; Capacitance: 15pF; Test Current: 1mA; Working Voltage: 19V; Min Breakdown Voltage: 6V; Peak Pulse Current: 3A; Operating Supply Voltage: 950mV; Max Operating Temperature: 85°C; Packaging: Tape and Reel; Termination: SMD/SMT; Number of Pins: 6; Radiation Hardening: No; Width: 1.05mm; REACH SVHC: No SVHC; Lead Free: Lead Free; Depth: 1mm; Package Quantity: 5000; Length: 1.45mm; Direction: Unidirectional; Min Operating Temperature: -40°C; Number of Channels: 4; Max Power Dissipation: 60W; Height: 0.55mm
Y5 = CMP-27762-011014-1: Crystal 12MHz ±30ppm 10pF SMD-4 2.5mm x 2mm Automotive; Frequency Stability: 50ppm; ESR (Equivalent Series Resistance): 150R; Max Operating Temperature: 125°C; Frequency Tolerance: 30ppm; Frequency: 12MHz; RoHS Compliant: Yes; Mount: Surface Mount; Packaging: Tape and Reel; Case/Package: SMD/SMT; Load Capacitance: 10pF; Min Operating Temperature: -40°C; Length: 0.098inch; Height: 0.024inch; Width: 0.079inch; Ratings: AEC-Q200